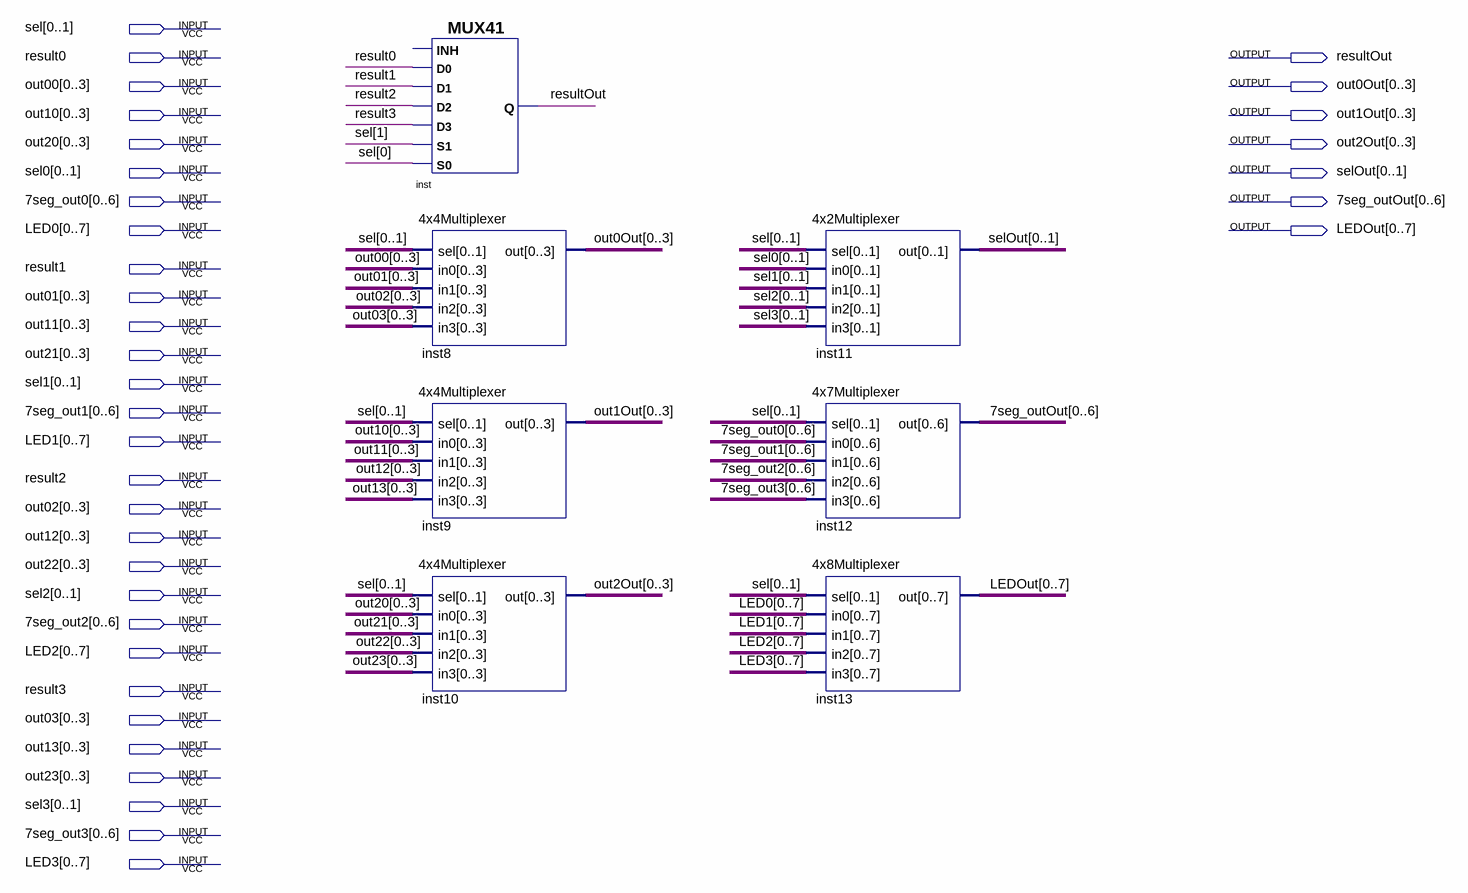
[diagram p0: schematic sheet]
// Quartus schematic SelectInput.bdf as structural Verilog: 7 symbols, 36 pins
module SelectInput (
  input  [0:1] sel,
  input  result0,
  input  [0:3] out00,
  input  [0:3] out10,
  input  [0:3] out20,
  input  [0:1] sel0,
  input  [0:6] \7seg_out0 ,
  input  [0:7] LED0,
  input  result1,
  input  [0:3] out01,
  input  [0:3] out11,
  input  [0:3] out21,
  input  [0:1] sel1,
  input  [0:6] \7seg_out1 ,
  input  [0:7] LED1,
  input  result2,
  input  [0:3] out02,
  input  [0:3] out12,
  input  [0:3] out22,
  input  [0:1] sel2,
  input  [0:6] \7seg_out2 ,
  input  [0:7] LED2,
  input  result3,
  input  [0:3] out03,
  input  [0:3] out13,
  input  [0:3] out23,
  input  [0:1] sel3,
  input  [0:6] \7seg_out3 ,
  input  [0:7] LED3,
  output resultOut,
  output [0:3] out0Out,
  output [0:3] out1Out,
  output [0:3] out2Out,
  output [0:1] selOut,
  output [0:6] \7seg_outOut ,
  output [0:7] LEDOut
);

  MUX41 inst (
    .S0(sel[0]), .D2(result2), .S1(sel[1]), .D3(result3), .D0(result0), .D1(result1), .Q(resultOut));  // open: INH
  \4x4Multiplexer  inst8 (.sel(sel), .in0(out00), .in1(out01), .in2(out02), .in3(out03), .out(out0Out));
  \4x4Multiplexer  inst9 (.sel(sel), .in0(out10), .in1(out11), .in2(out12), .in3(out13), .out(out1Out));
  \4x4Multiplexer  inst10 (.sel(sel), .in0(out20), .in1(out21), .in2(out22), .in3(out23), .out(out2Out));
  \4x2Multiplexer  inst11 (.sel(sel), .in0(sel0), .in1(sel1), .in2(sel2), .in3(sel3), .out(selOut));
  \4x7Multiplexer  inst12 (
    .sel(sel), .in0(\7seg_out0 ), .in1(\7seg_out1 ), .in2(\7seg_out2 ), .in3(\7seg_out3 ), .out(\7seg_outOut ));
  \4x8Multiplexer  inst13 (.sel(sel), .in0(LED0), .in1(LED1), .in2(LED2), .in3(LED3), .out(LEDOut));
endmodule
